# Altium schematic sheet VESC1SC.SchDoc
size A3; ApprovedBy: AAK; CheckedBy: AAK; Author: AAK; CompanyName: AAK; DrawnBy: AAK; Engineer: AAK; SheetNumber: 1; SheetTotal: 1
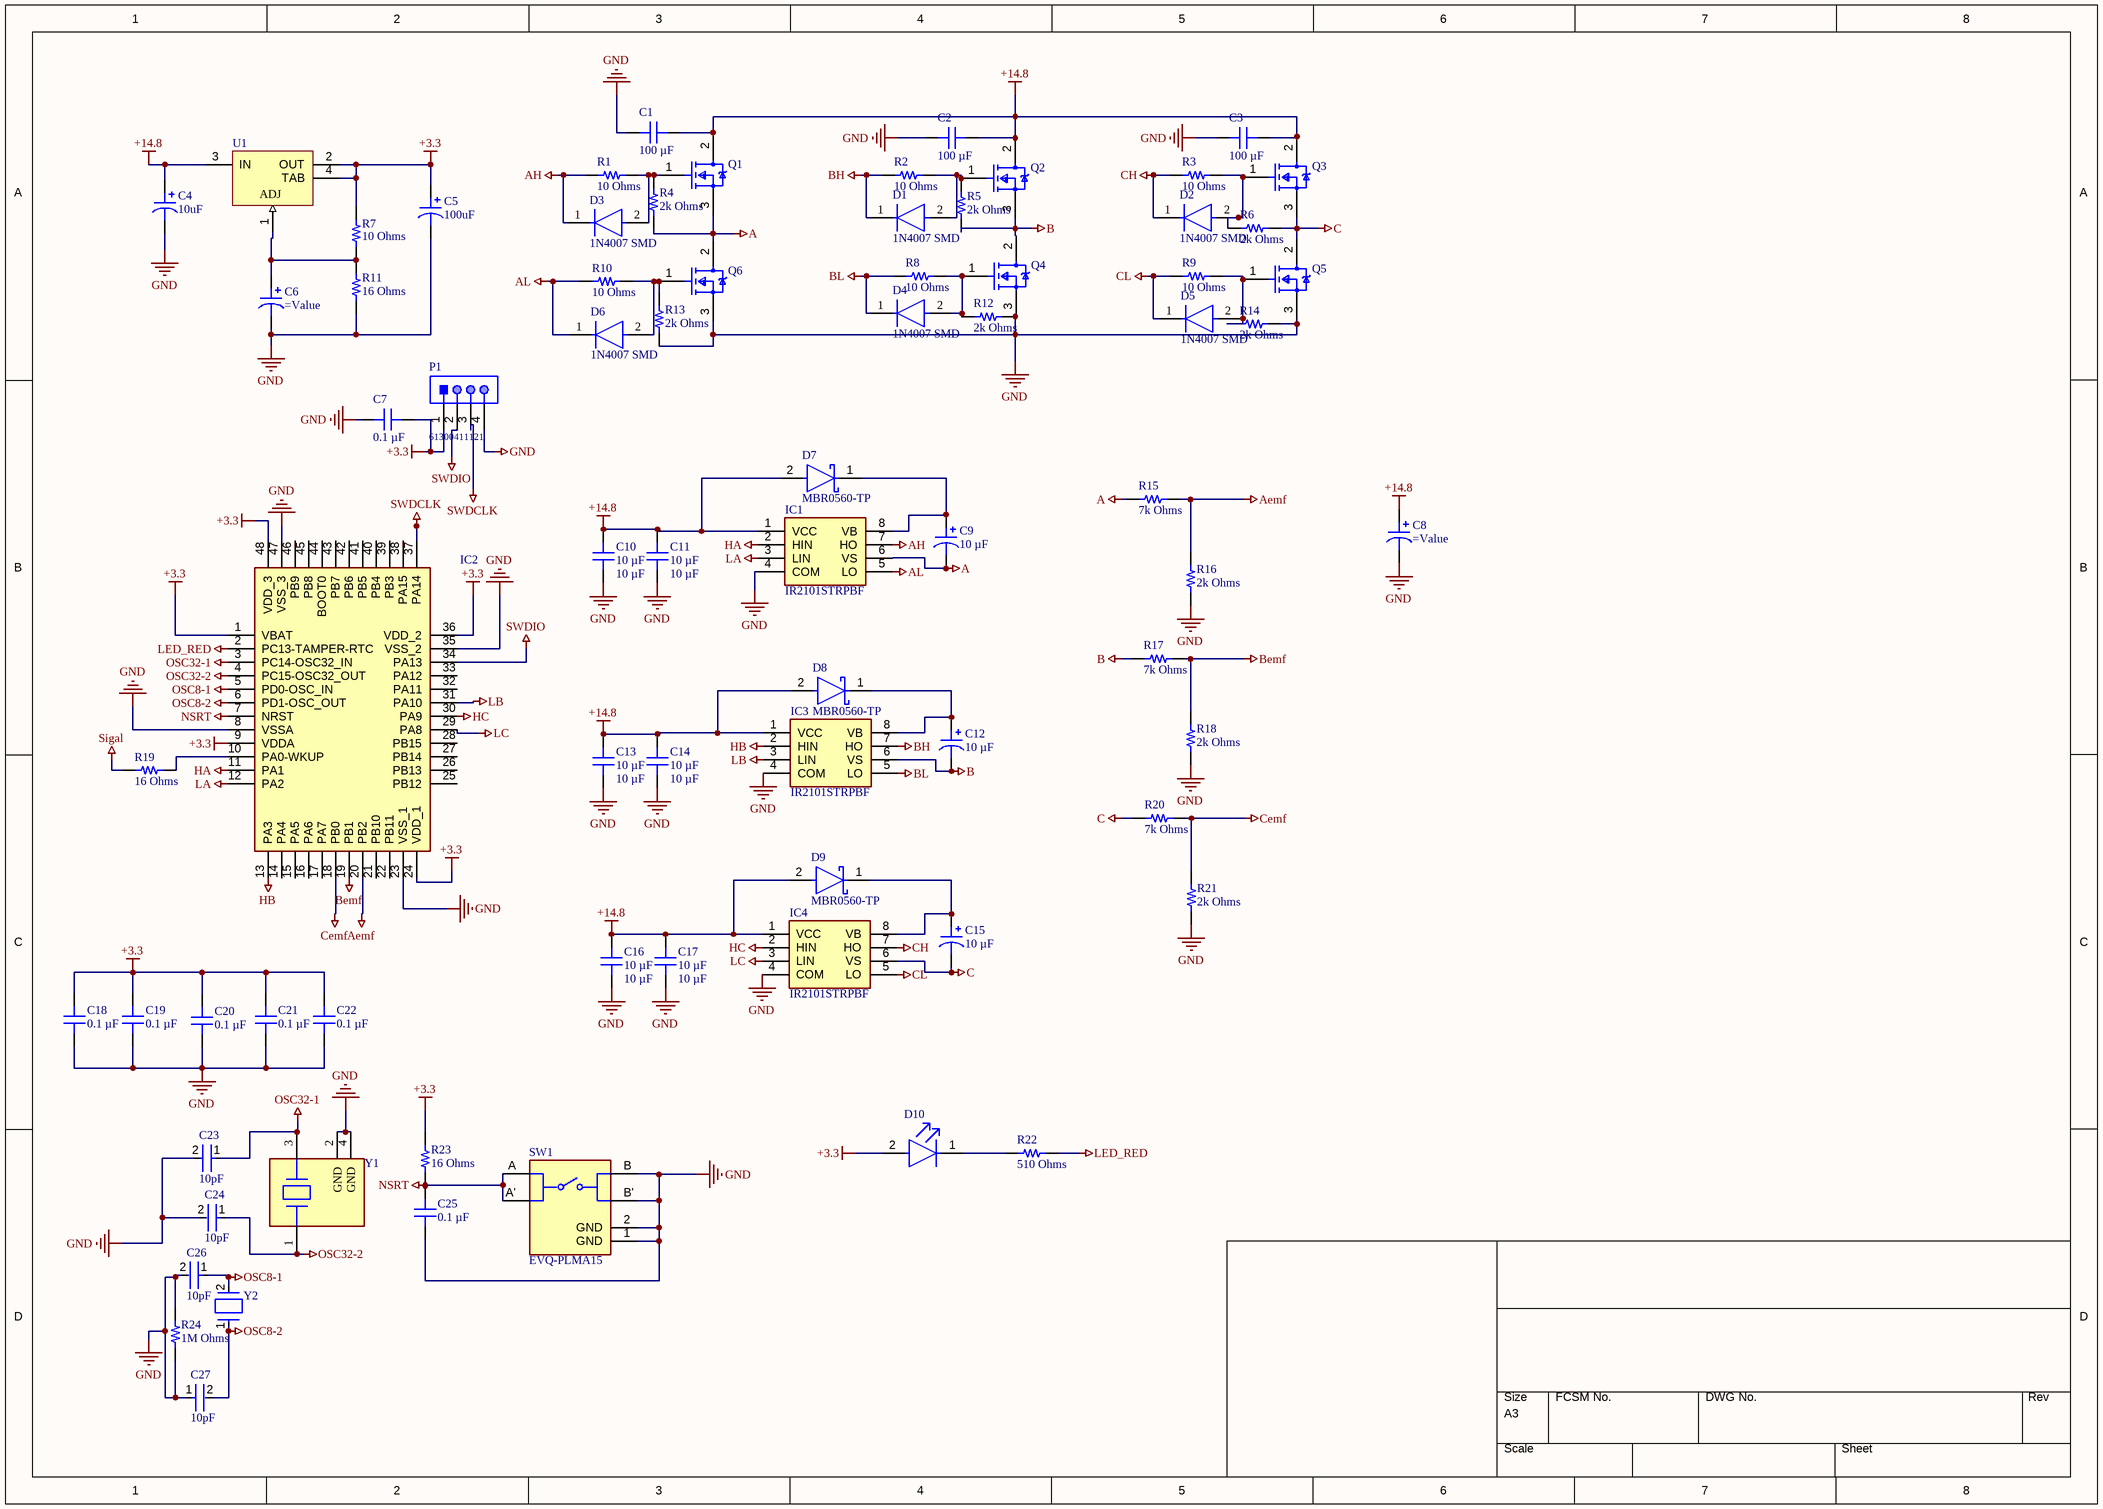
[diagram p0: VESC1SC.SchDoc]

## Parts
C1  100 µF  [CAP 0805_2012]
C2  100 µF  [CAP 0805_2012]
C3  100 µF  [CAP 0805_2012]
C4  10uF  [CAP ALSMD 4.3MM H5.4MM]
C5  100uF  [CAP ALSMD 4.3MM H5.4MM]
C6  (no value)  [CAP ALSMD 4.3MM H5.4MM]
C7  0.1 µF  [CAP 0805_2012]
C8  (no value)  [CAP TH ALUM ELEC D5.00mm S2.50mm H12.00mm]
C9  10 µF  [CAP ALSMD 4.3MM H5.4MM]
C10  10 µF  [CAP 0805_2012]
C11  10 µF  [CAP 0805_2012]
C12  10 µF  [CAP ALSMD 4.3MM H5.4MM]
C13  10 µF  [CAP 0805_2012]
C14  10 µF  [CAP 0805_2012]
C15  10 µF  [CAP ALSMD 4.3MM H5.4MM]
C16  10 µF  [CAP 0805_2012]
C17  10 µF  [CAP 0805_2012]
C18  0.1 µF  [CAP 0805_2012]
C19  0.1 µF  [CAP 0805_2012]
C20  0.1 µF  [CAP 0805_2012]
C21  0.1 µF  [CAP 0805_2012]
C22  0.1 µF  [CAP 0805_2012]
C23  10pF  [FP-C0805C-DN-MFG]
C24  10pF  [FP-C0805C-DN-MFG]
C25  0.1 µF  [CAP 0805_2012]
C26  10pF  [FP-C0805C-DN-MFG]
C27  10pF  [FP-C0805C-DN-MFG]
D1  1N4007 SMD  [FP-1N4007_SMD-IPC_C]
D2  1N4007 SMD  [FP-1N4007_SMD-IPC_C]
D3  1N4007 SMD  [FP-1N4007_SMD-IPC_C]
D4  1N4007 SMD  [FP-1N4007_SMD-IPC_C]
D5  1N4007 SMD  [FP-1N4007_SMD-IPC_C]
D6  1N4007 SMD  [FP-1N4007_SMD-IPC_C]
D7  MBR0560-TP  [FP-SOD-123-IPC_C]
D8  MBR0560-TP  [FP-SOD-123-IPC_C]
D9  MBR0560-TP  [FP-SOD-123-IPC_C]
D10  CMD15-21VRD/TR8  [FP-CMD15-21-MFG]  (value not drawn)
IC1  IR2101STRPBF  [SOIC127P600X175-8N]
IC2  STM32F103C8T7  [QFP50P900X900X160-48N]  (value not drawn)
IC3  IR2101STRPBF  [SOIC127P600X175-8N]
IC4  IR2101STRPBF  [SOIC127P600X175-8N]
P1  61300411121  [61300411121]
Q1  IRF3205STRLPBF  [FP-PG-TO263-3-MFG]  (value not drawn)
Q2  IRF3205STRLPBF  [FP-PG-TO263-3-MFG]  (value not drawn)
Q3  IRF3205STRLPBF  [FP-PG-TO263-3-MFG]  (value not drawn)
Q4  IRF3205STRLPBF  [FP-PG-TO263-3-MFG]  (value not drawn)
Q5  IRF3205STRLPBF  [FP-PG-TO263-3-MFG]  (value not drawn)
Q6  IRF3205STRLPBF  [FP-PG-TO263-3-MFG]  (value not drawn)
R1  10 Ohms  [RES 0603_1608]
R2  10 Ohms  [RES 0603_1608]
R3  10 Ohms  [RES 0603_1608]
R4  2k Ohms  [RES 0603_1608]
R5  2k Ohms  [RES 0603_1608]
R6  2k Ohms  [RES 0603_1608]
R7  10 Ohms  [RES 0603_1608]
R8  10 Ohms  [RES 0603_1608]
R9  10 Ohms  [RES 0603_1608]
R10  10 Ohms  [RES 0603_1608]
R11  16 Ohms  [RES 0603_1608]
R12  2k Ohms  [RES 0603_1608]
R13  2k Ohms  [RES 0603_1608]
R14  2k Ohms  [RES 0603_1608]
R15  7k Ohms  [RES 0603_1608]
R16  2k Ohms  [RES 0603_1608]
R17  7k Ohms  [RES 0603_1608]
R18  2k Ohms  [RES 0603_1608]
R19  16 Ohms  [RES 0603_1608]
R20  7k Ohms  [RES 0603_1608]
R21  2k Ohms  [RES 0603_1608]
R22  510 Ohms  [RES 0603_1608]
R23  16 Ohms  [RES 0603_1608]
R24  1M Ohms  [RES 0603_1608]
SW1  EVQ-PLMA15  [FP-EVQ-PLMA15-MFG]
U1  LM1117MPX-ADJ/NOPB  [DCY0004A_N]  (value not drawn)
Y1  ABM3B-155-12.800MHZ-T  [FP-ABM3B-MFG]  (value not drawn)
Y2  ABM3-8.000MHZ-D2Y-T  [FP-ABM3-MFG]  (value not drawn)

## Nets
+3.3: C5.1 C7.1 C18.2 C19.2 C20.2 C21.2 C22.2 D10.2(A) IC2.1(VBAT) IC2.9(VDDA) IC2.24(VDD_1) IC2.36(VDD_2) IC2.48(VDD_3) P1.1 R7.2 R23.1 U1.2(OUT) U1.4(TAB)
+14.8: C1.1 C2.1 C3.1 C4.1 C8.1 C10.2 C11.2 C13.2 C14.2 C16.2 C17.2 D7.2(A) D8.2(A) D9.2(A) IC1.1(VCC) IC3.1(VCC) IC4.1(VCC) Q1.2(D) Q2.2(D) Q3.2(D) U1.3(IN)
A: C9.2 IC1.6(VS) Q1.3(S) Q6.2(D) R4.1 R15.1
Aemf: IC2.20(PB2) R15.2 R16.2
AH: D3.1(C) IC1.7(HO) R1.1
AL: D6.1(C) IC1.5(LO) R10.1
B: C12.2 IC3.6(VS) Q2.3(S) Q4.2(D) R5.1 R17.1
Bemf: IC2.19(PB1) R17.2 R18.2
BH: D1.1(C) IC3.7(HO) R2.1
BL: D4.1(C) IC3.5(LO) R8.1
C: C15.2 IC4.6(VS) Q3.3(S) Q5.2(D) R6.1 R20.1
Cemf: IC2.18(PB0) R20.2 R21.2
CH: D2.1(C) IC4.7(HO) R3.1
CL: D5.1(C) IC4.5(LO) R9.1
GND: C1.2 C2.2 C3.2 C4.2 C5.2 C6.2 C7.2 C8.2 C10.1 C11.1 C13.1 C14.1 C16.1 C17.1 C18.1 C19.1 C20.1 C21.1 C22.1 C23.2 C24.2 C25.1 C26.2 C27.1 IC1.4(COM) IC2.8(VSSA) IC2.23(VSS_1) IC2.35(VSS_2) IC2.47(VSS_3) IC3.4(COM) IC4.4(COM) P1.4 Q4.3(S) Q5.3(S) Q6.3(S) R11.1 R12.1 R13.1 R14.1 R16.1 R18.1 R21.1 R24.1 R24.2 SW1.1(GND) SW1.2(GND) SW1.B SW1.B' Y1.2(GND) Y1.4(GND)
HA: IC1.2(HIN) IC2.11(PA1)
HB: IC2.13(PA3) IC3.2(HIN)
HC: IC2.30(PA9) IC4.2(HIN)
LA: IC1.3(LIN) IC2.12(PA2)
LB: IC2.31(PA10) IC3.3(LIN)
LC: IC2.29(PA8) IC4.3(LIN)
LED_RED: IC2.2(PC13-TAMPER-RTC) R22.2
NSRT: C25.2 IC2.7(NRST) R23.2 SW1.A SW1.A'
OSC8-1: C26.1 IC2.5(PD0-OSC_IN) Y2.2
OSC8-2: C27.2 IC2.6(PD1-OSC_OUT) Y2.1
OSC32-1: C23.1 IC2.3(PC14-OSC32_IN) Y1.3
OSC32-2: C24.1 IC2.4(PC15-OSC32_OUT) Y1.1
Sigal: R19.2
SWDCLK: IC2.37(PA14) P1.3
SWDIO: IC2.34(PA13) P1.2
NetC6_1: C6.1 R7.1 R11.2 U1.1(ADJ)
NetC9_1: C9.1 D7.1(C) IC1.8(VB)
NetC12_1: C12.1 D8.1(C) IC3.8(VB)
NetC15_1: C15.1 D9.1(C) IC4.8(VB)
NetD1_2: D1.2(A) Q2.1(G) R2.2 R5.2
NetD2_2: D2.2(A) Q3.1(G) R3.2 R6.2
NetD3_2: D3.2(A) Q1.1(G) R1.2 R4.2
NetD4_2: D4.2(A) Q4.1(G) R8.2 R12.2
NetD5_2: D5.2(A) Q5.1(G) R9.2 R14.2
NetD6_2: D6.2(A) Q6.1(G) R10.2 R13.2
NetD10_1: D10.1(C) R22.1
NetIC2_10: IC2.10(PA0-WKUP) R19.1

Not connected (* = marked no-connect by the designer): IC2 14(PA4) 15(PA5) 16(PA6) 17(PA7) 21(PB10) 22(PB11) 25(PB12) 26(PB13) 27(PB14) 28(PB15) 32(PA11) 33(PA12) 38(PA15) 39(PB3) 40(PB4) 41(PB5) 42(PB6) 43(PB7) 44(BOOT0) 45(PB8) 46(PB9)

## Notes on the sheet
- 8
- 7
- 6
- 5
- 4
- 3
- DWG. NO.
- REV.
- SHT.
- REVISION
- 2
- DESCRIPTION
- DATE
- 1
- APPROVED
- THIS DOCUMENT AND THE DATA DISCLOSED HEREIN OR HEREWITH IS THE PROPERTY OF ALTIUM LIMITED AND MAY BE FREELY DISTRIBUTED IN WHOLE. NO RIGHTS ARE RESERVED OR EXPRESS OR IMPLIED WARANTEE GIVEN.
- F
- E
- D
- C
- B
- ENG:
- APPROVALS
- PROJECT
- A
- DSN:
- CHK:
- REFERENCE DOCUMENTS
- PROJECT REVISION:
- TITLE
- DOCUMENT REVISION:
- DESIGN ITEM:
- BOM:
- FAB DWG:
- PCB DWG:
- ASSY DWG:
- SCALE:
- A3
- SIZE
- CAGE CODE
- FILE NAME
- DWG NO.
- SHEET
- OF
- REV

## Library data of the parts
C1-C3 = PMK212BBJ107MG-T: CAP CER 100UF 2.5V X5R 0805; manufacturer: Taiyo Yuden; Tolerance: ±20%; Part Number: PMK212BBJ107MG-T; Value: 100 µF; Applications: SMPS Filtering; Capacitance: 100 µF; componentlink1description: Datasheet; componentlink1url: https://ds.yuden.co.jp/TYCOMPAS/ut/detail?pn=PMK212BBJ107MG-T  &u=M; componentlink2description: DigiKey Link; componentlink2url: https://www.digikey.com/en/products/detail/taiyo-yuden/PMK212BBJ107MG-T/4950524; Device Package: 0805 (2012 Metric); lastupdated: 23.05.2022 12:57:57; Lifecycle Status: Active; Minimum Order: 1; Mounting Type: Surface Mount, MLCC; Operating Temperature: -55°C ~ 85°C; Package / Case: 0805 (2012 Metric); packaging: TapeAndReel; partid: 7580; Part Status: Active; price: 0.60; series: M; Size / Dimension: 0.079" L x 0.049" W (2.00mm x 1.25mm); Supplier 1: DigiKey; Supplier Part Number 1: 587-3978-1-ND; Temperature Coefficient: X5R; Thickness (Max): 0.053" (1.35mm); Voltage - Rated: 2.5V
C4-C6 = UWX1C100MCL1GB: CAP ALUM 10UF 20% 16V SMD; Part Number: UWX1C100MCL1GB
C7 C18-C22 C25 = HMK212BJ104KG-T: CAP CER 0.1UF 100V X5R 0805; manufacturer: Taiyo Yuden; Tolerance: ±10%; Part Number: HMK212BJ104KG-T; Value: 0.1 µF; Applications: SMPS Filtering; Capacitance: 0.1 µF; componentlink1description: Datasheet; componentlink1url: https://www.yuden.co.jp/productdata/catalog/mlcc01_e.pdf; componentlink2description: DigiKey Link; componentlink2url: https://www.digikey.com/en/products/detail/taiyo-yuden/HMK212BJ104KG-T/4970697; Device Package: 0805 (2012 Metric); Features: High Voltage; lastupdated: 23.05.2022 12:58:06; Lifecycle Status: Active; Minimum Order: 1; Mounting Type: Surface Mount, MLCC; Operating Temperature: -55°C ~ 85°C; Package / Case: 0805 (2012 Metric); packaging: TapeAndReel; partid: 3711; Part Status: Active; price: 0.04; series: M; Size / Dimension: 0.079" L x 0.049" W (2.00mm x 1.25mm); Supplier 1: DigiKey; Supplier Part Number 1: 587-5863-1-ND; Temperature Coefficient: X5R; Thickness (Max): 0.053" (1.35mm); Voltage - Rated: 100V
C8 = ECA-1HHG100I: CAP ALUM 10UF 20% 50V RADIAL; Part Number: ECA-1HHG100I
C9 C12 C15 = UWX1C100MCL1GB: CAP ALUM 10UF 20% 16V SMD; manufacturer: Nichicon; Lifetime @ Temp.: 2000 Hrs @ 85°C; Polarization: Polar; Ripple Current @ High Frequency: 34.5 mA @ 10 kHz; Ripple Current @ Low Frequency: 23 mA @ 120 Hz; Surface Mount Land Size: 0.169" L x 0.169" W (4.30mm x 4.30mm); Part Number: UWX1C100MCL1GB; Applications: General Purpose; Capacitance: 10 µF; componentlink1description: Datasheet; componentlink1url: https://products.nichicon.co.jp/en/pdf/XJA043/e-uwx.pdf; componentlink2description: DigiKey Link; componentlink2url: https://www.digikey.com/en/products/detail/nichicon/UWX1C100MCL1GB/589841; Device Package: Radial, Can - SMD; Height - Seated (Max): 0.213" (5.40mm); lastupdated: 23.05.2022 13:34:57; Lifecycle Status: Active; Minimum Order: 1; Mounting Type: Surface Mount; Operating Temperature: -40°C ~ 85°C; Package / Case: Radial, Can - SMD; packaging: TapeAndReel; partid: 7030; Part Status: Active; price: 0.06; series: UWX; Size / Dimension: 0.157" Dia (4.00mm); Supplier 1: DigiKey; Supplier Part Number 1: 493-2100-1-ND; Tolerance: ±20%; value: 10 µF; Voltage - Rated: 16 V
C10 C11 C13 C14 C16 C17 = C2012X6S1C106K125AC: CAP CER 10UF 16V X6S 0805; Part Number: C2012X6S1C106K125AC; Value: 10 µF
C23 C24 C26 C27 = CMP-2007-00219-2: Capacitor; Ceramic; Cap 10 pF; Tol 5%; Vol-Rtg 50 VDC; SMT; 0805; COG (NPO); Tape&Reel; Manufacturer Part Number: C0805C100J5GACTU; Manufacturer: KEMET; Temperature Coefficient: 30ppm/°C; Voltage Rating: 50 V; Tolerance: 0.05; Temperature Characteristic: C0G; RoHS: TRUE; Mouser Description: KEMET - C0805C100J5GACTU - CAP, MLCC, C0G/NP0, 10PF, 50V, 0805; Temperature Range High: +125°C; Octopart: https://octopart.com/c0805c100j5gactu-kemet-104357; Automotive: No; Device Class L1: Passive Components; Temperature Range Low: -55°C; Value: 10 pF; Device Class L3: Ceramic Capacitors; Material: Ceramic; Device Class L2: Capacitors; Lead Free: Yes; Category: Cap; Ipc Land Pattern Name: CAPC200125X78; ComponentLink2Description: Datasheet; ComponentLink2URL: https://content.kemet.com/datasheets/KEM_C1003_C0G_SMD.pdf; Digikey Description: Capacitor; Ceramic; Cap 10 pF; Tol 5%; Vol-Rtg 50 VDC; SMT; 0805; COG (NPO); Tape&Reel; Temperature: -55°C to +125°C; Height: 0.88mm; Capacitance: 10 pF; Package: C0805C-DN
D1-D6 = CMP-12389-000001-1: Rectifier, 1Kv, 1A, Do-214Ac Rohs Compliant: Yes
D7-D9 = CMP-56206-000010-1: DIODE SCHOTTKY 60V 500MA SOD123; Max Reverse Current: 200uA; Element Configuration: Single; Polarity: Standard; Capacitance: 30pF; Forward Voltage: 700mV; Peak Non-Repetitive Surge Current: 5.5A; Average Rectified Current: 500mA; Current Rating: 500mA; Max Reverse Voltage (DC): 60V; Max Operating Temperature: 150°C; Min Operating Temperature: -55°C; RoHS Compliant: Yes; Max Repetitive Reverse Voltage (Vrrm): 60V; Packaging: Tape and Reel; Voltage Rating (DC): 60V; Output Current: 500mA; Lead Free: Lead Free; Max Reverse Leakage Current: 200uA; Package Quantity: 1; Mount: Surface Mount; Max Surge Current: 5.5A; Radiation Hardening: No; Number of Pins: 2
D10 = CMP-53976-000002-1: LED RED DIFFUSED 1206 SMD; Manufacturer: VCC; Led Orientation: Top View; Peak Emmision Wavelength: 640nm; Forward Current: 20mA; Power Dissipation: 105mW; Luminous Intensity: 4mcd; Forward Voltage: 2V; Reverse Voltage: 5V; Lead Free: Yes; Device Class L1: Optoelectronics; Package: CMD15-21; Temperature Range High: +85°C; Digikey Description: LED RED DIFFUSED 1206 SMD; Mouser Description: Standard LEDs - SMD RED DIFFUSED; Height: 1.3mm; ComponentLink2Description: Datasheet; Manufacturer Part Number: CMD15-21VRD/TR8; ComponentLink2URL: https://www.vcclite.com/wp-content/uploads/wpallimport/files/files/CMD1521SeriesRev1.pdf; Temperature: -40°C to +85°C; Automotive: No; Octopart: https://octopart.com/cmd15-21vrd%2Ftr8-vcc-26668835; Temperature Range Low: -40°C; Device Class L3: unset; Colour: Red; Category: Diode; Device Class L2: LEDs; RoHS: TRUE
IC1 IC3 IC4 = IR2101STRPBF: Integrated Circuit; Manufacturer_Name: Infineon; Datasheet Link: http://uk.rs-online.com/web/p/products/1248778; Height: 1.75mm; Manufacturer_Part_Number: IR2101STRPBF; Mouser Part Number: 942-IR2101STRPBF; Mouser Price/Stock: https://www.mouser.co.uk/ProductDetail/Infineon-IR/IR2101STRPBF?qs=ellYJlE8XiER7yumWzaY8w%3D%3D; Arrow Part Number: IR2101STRPBF; Arrow Price/Stock: https://www.arrow.com/en/products/ir2101strpbf/infineon-technologies-ag?region=nac
IC2 = STM32F103C8T7: Integrated Circuit; Manufacturer_Name: STMicroelectronics; Datasheet Link: http://www.st.com/st-web-ui/static/active/en/resource/technical/document/datasheet/CD00161566.pdf; Height: 1.6mm; Manufacturer_Part_Number: STM32F103C8T7; Mouser Part Number: 511-STM32F103C8T7; Mouser Price/Stock: https://www.mouser.co.uk/ProductDetail/STMicroelectronics/STM32F103C8T7?qs=ZGWq6n3A68KjK%2FbZ7Ii58w%3D%3D; Arrow Part Number: STM32F103C8T7; Arrow Price/Stock: https://www.arrow.com/en/products/stm32f103c8t7/stmicroelectronics
P1 = CMP-1502-01064-1: THT Vertical Pin Header WR-PHD, Pitch 2.54 mm, Single Row, 4 pins; Manufacturer: Wurth Elektronik; Withstanding Voltage: 500VAC; Rated Current: 3A; Working Voltage: 250VAC; Pin Number: 4; Gender: Male; Contact Resistance: 20mOhm; Pitch: 2.54mm; Manufacturer URL: http://www.we-online.de; Operating Temperature: -40to105degC; Packaging: Bag; Mounting Technology: THT; Package Reference: 61300411121; Datasheet URL: https://katalog.we-online.de/em/datasheet/6130xx11121.pdf; Publisher: WurthElektronik; Part Number: 61300411121; Row Number: Single; Orientation: Vertical
Q1-Q6 = CMP-32901-000011-1: MOSFET N-CH 55V 110A D2PAK; Manufacturer: Infineon Technologies; Threshold Vgs Min: 2V; Turn Off Delay Time: 50ns; Pulse Drain Current: 390A; Max Forward Diode Voltage: 1.3V; Number Of Channels: 1; Threshold Vgs Max: 4V; Gate To Source Voltage: 20V; Input Capacitace At Vds: 3247pF @ 25V; Depletion Mode: False; Reverse Recovery Time: 69ns; Standoff Height: 0mm; Turn On Delay Time: 14ns; Gate Charge At Vgs: 146nC @ 10V; Drain To Source Resistance: 8mΩ; Rthja Max: 40°C/W; Power Dissipation: 200W; Max Junction Temp: +175°C; Reverse Recovery Charge: 143nC; ComponentLink2Description: Datasheet; Temperature Range Low: -55°C; ComponentLink2URL: https://www.infineon.com/dgdl/irf3205spbf.pdf?fileId=5546d462533600a4015355defac9190c; Automotive: No; Height: 5.084mm; Lead Free: Yes; Device Class L1: Discrete Semiconductors; Drain To Source Voltage: 55V; Device Class L3: MOSFETs; Temperature: -55°C to +175°C; Drain To Source Breakdown Voltage: 55V; Manufacturer Part Number: IRF3205STRLPBF; Temperature Range High: +175°C; Device Class L2: Transistors; Octopart: https://octopart.com/irf3205strlpbf-infineon-65873335; Digikey Description: MOSFET N-CH 55V 110A D2PAK; RoHS: TRUE; Number Of N Channels: 1; Continuous Drain Current: 110A; Category: Trans; Package: PG-TO263-3
R1-R24 = RNCS0603BKE10K0: RES 10K OHM 0.1% 1/16W 0603; Manufacturer: Stackpole Electronics Inc; Power (Watts): 0.063W, 1/16W; Resistance: 10 kOhms; Temperature Coefficient: ±25ppm/°C; Part Number: RNCS0603BKE10K0; ComponentLink1Description: Datasheet; ComponentLink1URL: https://www.seielect.com/catalog/sei-rncs_rnch.pdf; ComponentLink2Description: DigiKey Link; ComponentLink2URL: https://www.digikey.com/en/products/detail/stackpole-electronics-inc/RNCS0603BKE10K0/1708836; Composition: Thin Film; Device Package: 0603 (1608 Metric); Features: Anti-Corrosive, Automotive AEC-Q200, Moisture Resistant; Height - Seated (Max): 0.022" (0.55mm); LastUpdated: 23.05.2022 13:14:49; Lifecycle Status: Active; Minimum Order: 1; Number of Terminations: 2; Operating Temperature: -55°C ~ 155°C; Package / Case: 0603 (1608 Metric); Packaging: TapeAndReel; PartId: 4838; Part Status: Active; Price: 0.08; Ratings: AEC-Q200; Series: RNCS; Size / Dimension: 0.061" L x 0.031" W (1.55mm x 0.80mm); Supplier 1: DigiKey; Supplier Part Number 1: RNCS0603BKE10K0CT-ND; Supplier Device Package: 0603; Tolerance: ±0.1%
  R1-R3 R7-R10: Value: 10 Ohms
  R4-R6 R12-R14 R16 R18 R21: Value: 2k Ohms
  R11 R19 R23: Value: 16 Ohms
  R15 R17 R20: Value: 7k Ohms
  R22: Value: 510 Ohms
  R24: Value: 1M Ohms
SW1 = CMP-05618-000006-1: SWITCH TACTILE SPST-NO 0.02A 15V; Manufacturer: Panasonic Electronic Components; Operating Force: 2.6N; Contact Resistance: 50mΩ; Contact Current Rating: 20mA; Electromechanical Life: 200000Cycles; Throw Configuration: SPST-NO; Automotive: No; Digikey Description: SWITCH TACTILE SPST-NO 0.02A 15V; Device Class L3: Tactile Switches; Device Class L2: Switches; Temperature Range Low: -20°C; ComponentLink2Description: Datasheet; RoHS: TRUE; Mount: Surface Mount; Package: 0; Height: 1.7mm; Octopart: https://octopart.com/evq-plma15-panasonic-39850235; Temperature Range High: +70°C; Device Class L1: Electromechanical; Category: Switch; Mouser Description: Tactile Switches FLAT ACT 2.6NF 4.6x3.4x1.5mm; Voltage Rating Dc: 15V; Manufacturer Part Number: EVQ-PLMA15; ComponentLink2URL: https://datasheet.ciiva.com/8164/atv0000ce2-8164994.pdf; Lead Free: Yes; Temperature: -20°C to +70°C
U1 = CMP-0062-01644-4: 800mA Low-Dropout Linear Regulator, 4-pin SOT-223, Pb-Free; Manufacturer: Texas Instruments; CompType: LDO IC; PowerWise: N; PackageTopMarking: XYTT*N03A; High-Reliability: Y; PackageDescription: Molded SOT-223, 6.50 x 3.56 x 1.6mm Body, 4 Lead, 2.3mm Pitch; RoHS: Y; ComponentLink1URL: http://www.ti.com/general/docs/lit/getliterature.tsp?genericPartNumber=LM1117-N&fileType=pdf; Code_JEDEC: TO-261-AA; ComponentLink1Description: Datasheet URL; PartNumber: LM1117MPX-ADJ/NOPB; PackageReference: DCY0004A; Code_IPC: SOT223-4; PinCount: 4
Y1 = CMP-27762-002684-1: Crystal 12.8MHz ±10ppm 15pF SMD-4 5mm x 3.2mm; ESR (Equivalent Series Resistance): 70R; Tolerance: 50ppm; Frequency Stability: 20ppm; Height: 0.043inch; Series: ABM3B; Resistor Type: Ceramic; Frequency: 12.8MHz; Mount: Surface Mount; Package Quantity: 1000; Packaging: Tape and Reel; Termination: SMD/SMT; Lead Free: Lead Free; Case/Package: SMD/SMT; Load Capacitance: 15pF; Frequency Tolerance: 10ppm; REACH SVHC: No SVHC; Min Operating Temperature: -40°C; Max Operating Temperature: 85°C; Width: 0.126inch; Length: 0.197inch; RoHS Compliant: Yes
Y2 = CMP-2000-05033-2: Crystal 8MHz ±20ppm 18pF SMD-2 5mm x 3.2mm; Series Resistance: 500R; Frequency Stability: 30ppm; ESR (Equivalent Series Resistance): 140R; Load Capacitance: 18pF; Height: 0.051inch; Tolerance: 20ppm; Depth: 3.2mm; Max Operating Temperature: 85°C; Frequency: 8MHz; Termination: SMD/SMT; Lead Free: Lead Free; Number of Pins: 2; Width: 3.2mm; RoHS Compliant: Yes; Resistor Type: Ceramic; Length: 5mm; Mount: Surface Mount; Case/Package: CSMD; Package Quantity: 1000; Radiation Hardening: No; Min Operating Temperature: -40°C; Packaging: Tape and Reel; Frequency Tolerance: 20ppm